# Altium schematic sheet Sheet1.SchDoc
size 635 x 254 mm; SheetNumber: 1; SheetTotal: 1
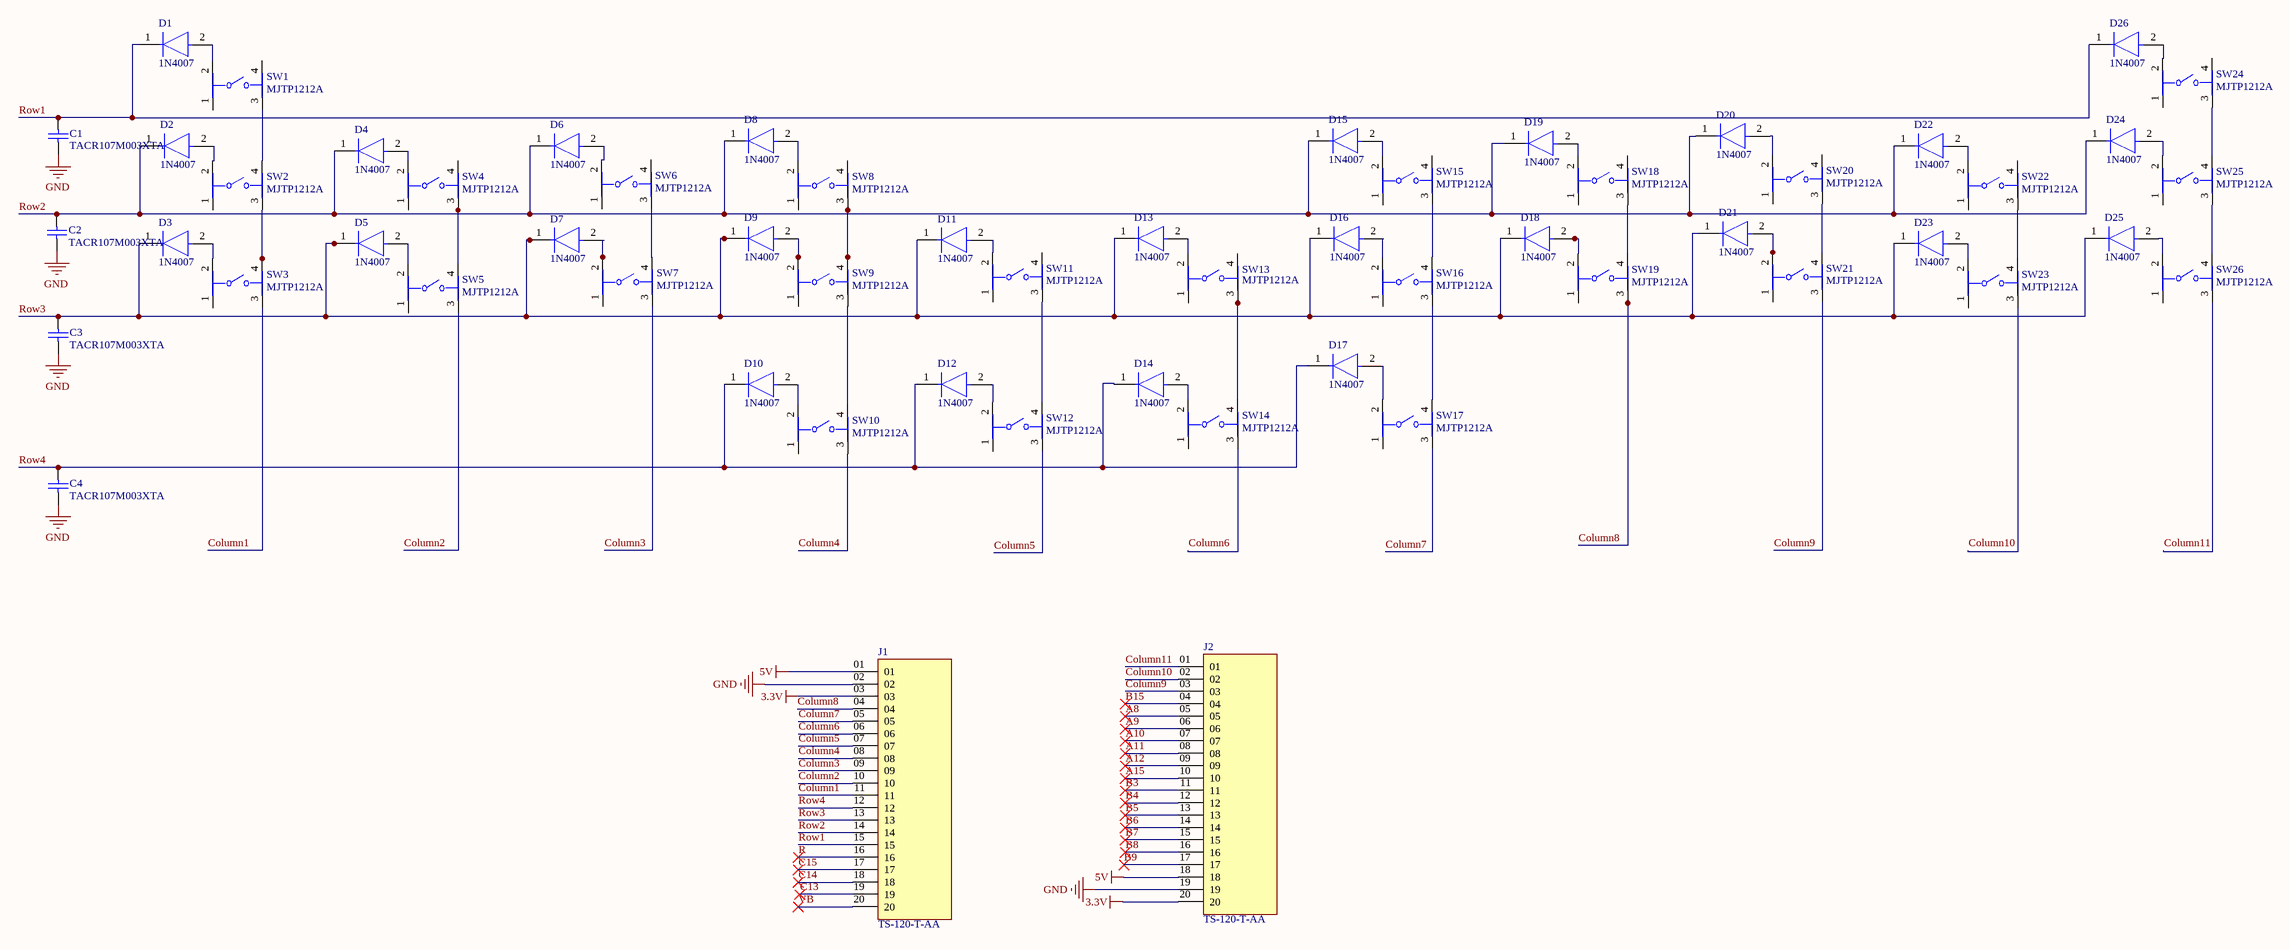
[diagram p0: Sheet1.SchDoc]

## Parts
C1  TACR107M003XTA  [CAPC2014X150X70ML20]
C2  TACR107M003XTA  [CAPC2014X150X70ML20]
C3  TACR107M003XTA  [CAPC2014X150X70ML20]
C4  TACR107M003XTA  [CAPC2014X150X70ML20]
D1  1N4007  [FP-1N4007-MFG]
D2  1N4007  [FP-1N4007-MFG]
D3  1N4007  [FP-1N4007-MFG]
D4  1N4007  [FP-1N4007-MFG]
D5  1N4007  [FP-1N4007-MFG]
D6  1N4007  [FP-1N4007-MFG]
D7  1N4007  [FP-1N4007-MFG]
D8  1N4007  [FP-1N4007-MFG]
D9  1N4007  [FP-1N4007-MFG]
D10  1N4007  [FP-1N4007-MFG]
D11  1N4007  [FP-1N4007-MFG]
D12  1N4007  [FP-1N4007-MFG]
D13  1N4007  [FP-1N4007-MFG]
D14  1N4007  [FP-1N4007-MFG]
D15  1N4007  [FP-1N4007-MFG]
D16  1N4007  [FP-1N4007-MFG]
D17  1N4007  [FP-1N4007-MFG]
D18  1N4007  [FP-1N4007-MFG]
D19  1N4007  [FP-1N4007-MFG]
D20  1N4007  [FP-1N4007-MFG]
D21  1N4007  [FP-1N4007-MFG]
D22  1N4007  [FP-1N4007-MFG]
D23  1N4007  [FP-1N4007-MFG]
D24  1N4007  [FP-1N4007-MFG]
D25  1N4007  [FP-1N4007-MFG]
D26  1N4007  [FP-1N4007-MFG]
J1  TS-120-T-AA  [SAMTEC_TS-120-T-AA]
J2  TS-120-T-AA  [SAMTEC_TS-120-T-AA]
SW1  MJTP1212A  [FP-MJTP1212A-MFG]
SW2  MJTP1212A  [FP-MJTP1212A-MFG]
SW3  MJTP1212A  [FP-MJTP1212A-MFG]
SW4  MJTP1212A  [FP-MJTP1212A-MFG]
SW5  MJTP1212A  [FP-MJTP1212A-MFG]
SW6  MJTP1212A  [FP-MJTP1212A-MFG]
SW7  MJTP1212A  [FP-MJTP1212A-MFG]
SW8  MJTP1212A  [FP-MJTP1212A-MFG]
SW9  MJTP1212A  [FP-MJTP1212A-MFG]
SW10  MJTP1212A  [FP-MJTP1212A-MFG]
SW11  MJTP1212A  [FP-MJTP1212A-MFG]
SW12  MJTP1212A  [FP-MJTP1212A-MFG]
SW13  MJTP1212A  [FP-MJTP1212A-MFG]
SW14  MJTP1212A  [FP-MJTP1212A-MFG]
SW15  MJTP1212A  [FP-MJTP1212A-MFG]
SW16  MJTP1212A  [FP-MJTP1212A-MFG]
SW17  MJTP1212A  [FP-MJTP1212A-MFG]
SW18  MJTP1212A  [FP-MJTP1212A-MFG]
SW19  MJTP1212A  [FP-MJTP1212A-MFG]
SW20  MJTP1212A  [FP-MJTP1212A-MFG]
SW21  MJTP1212A  [FP-MJTP1212A-MFG]
SW22  MJTP1212A  [FP-MJTP1212A-MFG]
SW23  MJTP1212A  [FP-MJTP1212A-MFG]
SW24  MJTP1212A  [FP-MJTP1212A-MFG]
SW25  MJTP1212A  [FP-MJTP1212A-MFG]
SW26  MJTP1212A  [FP-MJTP1212A-MFG]

## Nets
3.3V: J1.03 J2.20
5V: J1.01 J2.18
GND: C1.1 C2.1 C3.1 C4.1 J1.02 J2.19
A8: J2.05
A9: J2.06
A10: J2.07
A11: J2.08
A12: J2.09
A15: J2.10
B3: J2.11
B4: J2.12
B5: J2.13
B6: J2.14
B7: J2.15
B8: J2.16
B9: J2.17
B15: J2.04
C13: J1.19
C14: J1.18
C15: J1.17
Column1: J1.11 SW3.3
Column2: J1.10 SW5.3
Column3: J1.09 SW7.3
Column4: J1.08 SW10.3
Column5: J1.07 SW12.3
Column6: J1.06 SW14.3
Column7: J1.05 SW17.3
Column8: J1.04 SW19.3
Column9: J2.03 SW21.3
Column10: J2.02 SW23.3
Column11: J2.01 SW26.3
R: J1.16
Row1: C1.2 D1.1(C) D26.1(C) J1.15
Row2: C2.2 D2.1(C) D4.1(C) D6.1(C) D8.1(C) D15.1(C) D19.1(C) D20.1(C) D22.1(C) D24.1(C) J1.14
Row3: C3.2 D3.1(C) D5.1(C) D7.1(C) D9.1(C) D11.1(C) D13.1(C) D16.1(C) D18.1(C) D21.1(C) D23.1(C) D25.1(C) J1.13
Row4: C4.2 D10.1(C) D12.1(C) D14.1(C) D17.1(C) J1.12
VB: J1.20
NetD1_2: D1.2(A) SW1.2
NetD2_2: D2.2(A) SW2.2
NetD3_2: D3.2(A) SW3.2
NetD4_2: D4.2(A) SW4.2
NetD5_2: D5.2(A) SW5.2
NetD6_2: D6.2(A) SW6.2
NetD7_2: D7.2(A) SW7.2
NetD8_2: D8.2(A) SW8.2
NetD9_2: D9.2(A) SW9.2
NetD10_2: D10.2(A) SW10.2
NetD11_2: D11.2(A) SW11.2
NetD12_2: D12.2(A) SW12.2
NetD13_2: D13.2(A) SW13.2
NetD14_2: D14.2(A) SW14.2
NetD15_2: D15.2(A) SW15.2
NetD16_2: D16.2(A) SW16.2
NetD17_2: D17.2(A) SW17.2
NetD18_2: D18.2(A) SW19.2
NetD19_2: D19.2(A) SW18.2
NetD20_2: D20.2(A) SW20.2
NetD21_2: D21.2(A) SW21.2
NetD22_2: D22.2(A) SW22.2
NetD23_2: D23.2(A) SW23.2
NetD24_2: D24.2(A) SW25.2
NetD25_2: D25.2(A) SW26.2
NetD26_2: D26.2(A) SW24.2
NetSW1_3: SW1.3 SW2.4
NetSW2_3: SW2.3 SW3.4
NetSW4_3: SW4.3 SW5.4
NetSW6_3: SW6.3 SW7.4
NetSW8_3: SW8.3 SW9.4
NetSW9_3: SW9.3 SW10.4
NetSW11_3: SW11.3 SW12.4
NetSW13_3: SW13.3 SW14.4
NetSW15_3: SW15.3 SW16.4
NetSW16_3: SW16.3 SW17.4
NetSW18_3: SW18.3 SW19.4
NetSW20_3: SW20.3 SW21.4
NetSW22_3: SW22.3 SW23.4
NetSW24_3: SW24.3 SW25.4
NetSW25_3: SW25.3 SW26.4

Not connected (* = marked no-connect by the designer): SW1 1 4; SW2 1; SW3 1; SW4 1 4; SW5 1; SW6 1 4; SW7 1; SW8 1 4; SW9 1; SW10 1; SW11 1 4; SW12 1; SW13 1 4; SW14 1; SW15 1 4; SW16 1; SW17 1; SW18 1 4; SW19 1; SW20 1 4; SW21 1; SW22 1 4; SW23 1; SW24 1 4; SW25 1; SW26 1

## Library data of the parts
C1-C4 = CMP-2007-00028-1: Manufacturer: AVX Interconnect / Elco; Part Number: TACR107M003XTA
D1-D26 = CMP-123542-000001-1: Rectifier diode 1000 V 1 A DO-41, ,; Manufacturer: Diotec; Max Surge Forward Current: 27A; Forward Current: 1A; Max Junction Temp: +175°C; Reverse Voltage: 1000V; Value: 15pF; Peak Reverse Current: 5uA; Category: Diode; Temperature Range Low: -50°C; Automotive: No; Temperature: -50°C to +175°C; Lead Free: Yes; ComponentLink2Description: Datasheet; Max Repetitive Reverse Voltage: 1000V; ComponentLink2URL: https://datasheet.octopart.com/1N4007-Diotec-datasheet-62346875.pdf; Manufacturer Part Number: 1N4007; Device Class L3: Rectifier Diodes; Height: 2.8mm; Octopart: https://octopart.com/1n4007-diotec-4040411; Package: 1N4007; Temperature Range High: +175°C; Device Class L1: Discrete Semiconductors; Device Class L2: Diodes; RoHS: TRUE; Capacitance: 15pF; Ipc Land Pattern Name: DIOAD888W100L520D280
J1 J2 = TS-120-T-AA: Headers & Wire Housings .100 Single Row Screw Machine Terminal Strip; MF: Samtec; Package: None; Price: None; Check_prices: https://www.snapeda.com/parts/TS-120-T-AA/Samtec/view-part/?ref=eda; Value: *; SnapEDA_Link: https://www.snapeda.com/parts/TS-120-T-AA/Samtec/view-part/?ref=snap; MP: TS-120-T-AA; Availability: In Stock; Purchase-URL: https://pricing.snapeda.com/search?q=TS-120-T-AA&ref=eda
SW1-SW26 = CMP-47024-000003-1: SWITCH TACTILE SPST-NO 0.05A 12V; Contact Resistance: 100mR; Operating Force: 160gf; Mechanical Life: 100000Cycles; Actuator Length: 3.5mm; Throw Configuration: SPST; Illumination Type: Non-Illuminated; Actuator Material: Polyoxymethylene; Actuator Type: Standard; Switch Travel: 0.3mm; Current Rating: 50mA; Switch Function: Off-Mom; Mount: Through Hole; Contact Plating: Silver; Max Voltage Rating (DC): 12V; Package Quantity: 100; Max Operating Temperature: 70°C; Packaging: Bulk; Voltage Rating (DC): 12V; Termination: PC Pin; Contact Material: Bronze; Orientation: Straight; Min Operating Temperature: -20°C; REACH SVHC: No SVHC; Electrical Life: 100000Cycles